# EAGLE schematic UPU (EAGLE 7.6.0)
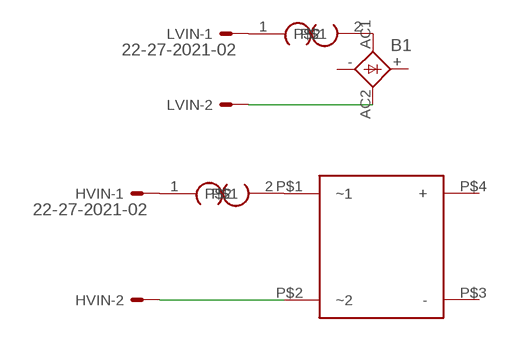
[diagram p0: schematic, sheet 1]

## Parts
B1  GBPC6  [GBPC6]
HVIN  22-27-2021-02  [6410-02]
LVIN  22-27-2021-02  [6410-02]
U$1  KWS25A  [KWS]
U$2  MMUFUSE  [0204V]
U$3  MMUFUSE  [0204V]

## Nets
N$1: B1.AC1 U$2.2
N$2: B1.AC2 LVIN.2
N$3: U$1.P$1(~1) U$3.2
N$4: HVIN.2 U$1.P$2(~2)
N$5: LVIN.1 U$2.1
N$6: HVIN.1 U$3.1
Unconnected: B1.+ B1.- U$1.P$3(-) U$1.P$4(+)

## Library data of the parts
B1 = rectifier:GBPC6: GENERAL INSTRUMENT RECTIFIER
HVIN LVIN = con-molex:22-?-02: CONNECTOR wire to board 2.54 mm (.1 inch) pitch header; OC_FARNELL: unknown; OC_NEWARK: unknown
U$1 = Football:KWS25A
U$2 U$3 = JSB2:MMUFUSE